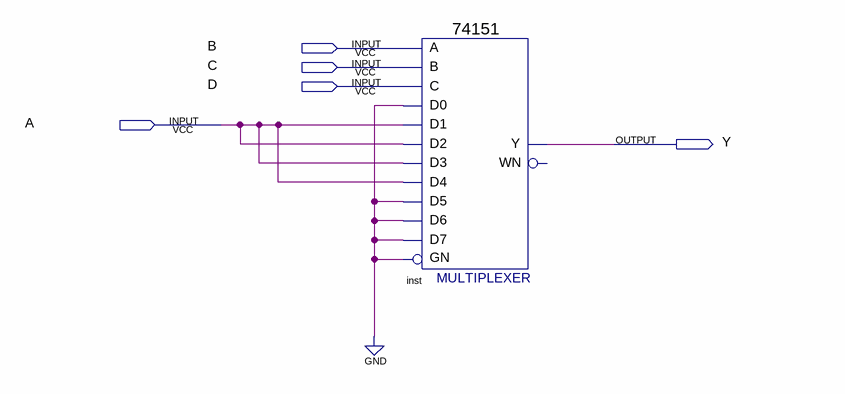
[diagram p0: schematic sheet]
// Quartus schematic Code3.bdf as structural Verilog: 1 symbols, 5 pins
module Code3 (
  input  B,
  input  C,
  input  D,
  input  A,
  output Y
);

  \74151  inst (
    .GN(1'b0), .C(D), .B(C), .A(B), .D5(1'b0), .D0(1'b0), .D1(A), .D4(A), .D3(A), .D2(A), .D6(1'b0),
    .D7(1'b0), .Y(Y));  // open: WN
endmodule
